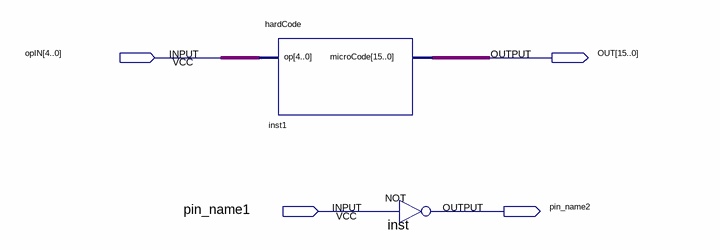
[diagram p0: schematic sheet]
// Quartus schematic t7.bdf as structural Verilog: 2 symbols, 4 pins
module t7 (
  input  [4:0] opIN,
  input  pin_name1,
  output [15:0] OUT,
  output pin_name2
);

  hardCode inst1 (.op(opIN), .microCode(OUT));
  not inst (pin_name2, pin_name1);
endmodule
